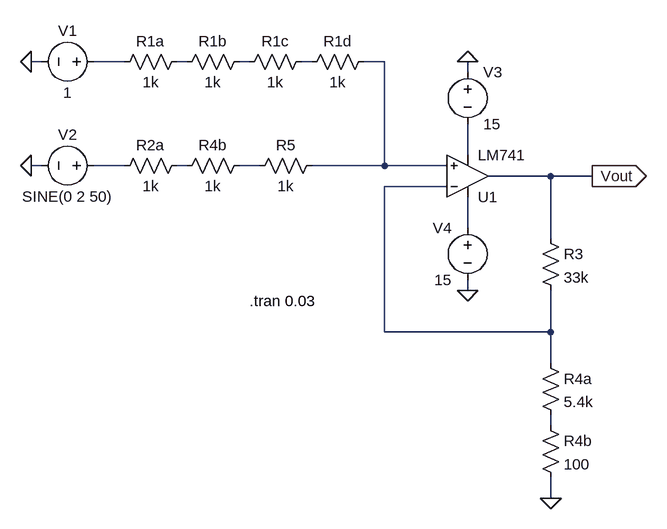
[diagram p0: schematic lab5_5.asc]
lab5_5.asc, the LTspice schematic file:
Version 4
SHEET 1 880 680
WIRE -448 -272 -464 -272
WIRE -320 -272 -368 -272
WIRE -224 -272 -240 -272
WIRE -128 -272 -144 -272
WIRE -32 -272 -48 -272
WIRE 80 -272 48 -272
WIRE 208 -256 208 -272
WIRE 208 -128 208 -176
WIRE -448 -112 -464 -112
WIRE -320 -112 -368 -112
WIRE -224 -112 -240 -112
WIRE -112 -112 -144 -112
WIRE 80 -112 80 -272
WIRE 80 -112 -32 -112
WIRE 176 -112 80 -112
WIRE 336 -96 240 -96
WIRE 400 -96 336 -96
WIRE 176 -80 80 -80
WIRE 208 -16 208 -64
WIRE 336 0 336 -96
WIRE 208 80 208 64
WIRE 80 144 80 -80
WIRE 336 144 336 80
WIRE 336 144 80 144
WIRE 336 192 336 144
WIRE 336 288 336 272
WIRE 336 400 336 368
FLAG 208 80 0
FLAG 208 -272 0
FLAG -464 -272 0
FLAG -464 -112 0
FLAG 336 400 0
FLAG 400 -96 Vout
IOPIN 400 -96 Out
SYMBOL OpAmps\\LM741 208 -32 M180
SYMATTR InstName U1
SYMBOL res -224 -288 R90
WINDOW 0 0 56 VBottom 2
WINDOW 3 32 56 VTop 2
SYMATTR InstName R1a
SYMATTR Value 1k
SYMBOL res -224 -128 R90
WINDOW 0 0 56 VBottom 2
WINDOW 3 32 56 VTop 2
SYMATTR InstName R2a
SYMATTR Value 1k
SYMBOL voltage -352 -272 R90
WINDOW 0 -32 56 VBottom 2
WINDOW 3 32 56 VTop 2
WINDOW 123 0 0 Left 0
WINDOW 39 0 0 Left 0
SYMATTR InstName V1
SYMATTR Value 1
SYMBOL voltage -352 -112 R90
WINDOW 0 -32 56 VBottom 2
WINDOW 3 32 56 VTop 2
WINDOW 123 0 0 Left 0
WINDOW 39 0 0 Left 0
SYMATTR InstName V2
SYMATTR Value SINE(0 2 50)
SYMBOL voltage 208 -272 R0
WINDOW 123 0 0 Left 0
WINDOW 39 0 0 Left 0
SYMATTR InstName V3
SYMATTR Value 15
SYMBOL voltage 208 -32 M0
WINDOW 123 0 0 Left 0
WINDOW 39 0 0 Left 0
SYMATTR InstName V4
SYMATTR Value 15
SYMBOL res 320 -16 R0
SYMATTR InstName R3
SYMATTR Value 33k
SYMBOL res 320 176 R0
SYMATTR InstName R4a
SYMATTR Value 5.4k
SYMBOL res -128 -288 R90
WINDOW 0 0 56 VBottom 2
WINDOW 3 32 56 VTop 2
SYMATTR InstName R1b
SYMATTR Value 1k
SYMBOL res 320 272 R0
SYMATTR InstName R4b
SYMATTR Value 100
SYMBOL res -128 -128 R90
WINDOW 0 0 56 VBottom 2
WINDOW 3 32 56 VTop 2
SYMATTR InstName R4b
SYMATTR Value 1k
SYMBOL res -16 -128 R90
WINDOW 0 0 56 VBottom 2
WINDOW 3 32 56 VTop 2
SYMATTR InstName R5
SYMATTR Value 1k
SYMBOL res -32 -288 R90
WINDOW 0 0 56 VBottom 2
WINDOW 3 32 56 VTop 2
SYMATTR InstName R1c
SYMATTR Value 1k
SYMBOL res 64 -288 R90
WINDOW 0 0 56 VBottom 2
WINDOW 3 32 56 VTop 2
SYMATTR InstName R1d
SYMATTR Value 1k
TEXT -128 96 Left 2 !.tran 0.03

The netlist it stands for:
* lab5_5.asc
XU1 N005 N010 N011 N006 Vout LM741  ; pins In+ In- V+ V- OUT
R1a N002 N001 1k
R2a N008 N007 1k
V1 N001 0 1
V2 N007 0 SINE(0 2 50)
V3 0 N006 15
V4 N011 0 15
R3 Vout N010 33k
R4a N010 N012 5.4k
R1b N003 N002 1k
R4b N012 0 100
R4b N009 N008 1k
R5 N005 N009 1k
R1c N004 N003 1k
R1d N005 N004 1k
.tran 0.03
.lib LM741.lib
.backanno
.end